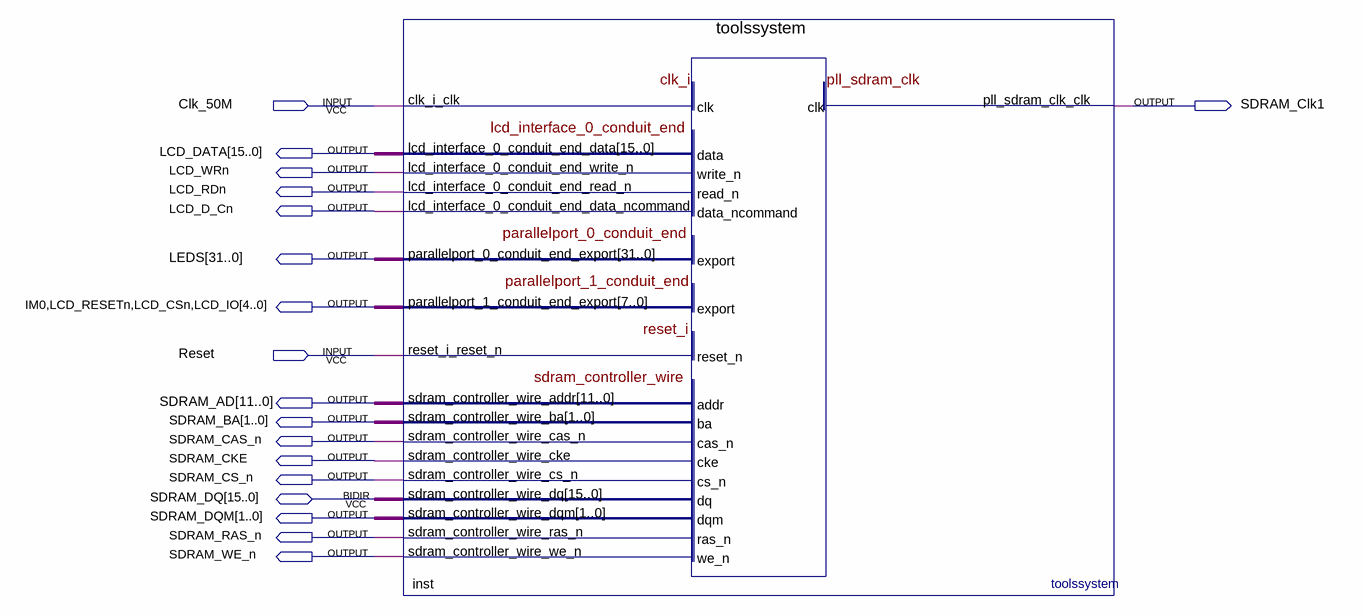
[diagram p0: schematic sheet]
// Quartus schematic tools.bdf as structural Verilog: 1 symbols, 18 pins
module tools (
  input  Clk_50M,
  input  Reset,
  inout  [15:0] SDRAM_DQ,
  output SDRAM_Clk1,
  output [15:0] LCD_DATA,
  output LCD_WRn,
  output LCD_RDn,
  output LCD_D_Cn,
  output [31:0] LEDS,
  output IM0,
  output LCD_RESETn,
  output LCD_CSn,
  output [4:0] LCD_IO,
  output [11:0] SDRAM_AD,
  output [1:0] SDRAM_BA,
  output SDRAM_CAS_n,
  output SDRAM_CKE,
  output SDRAM_CS_n,
  output [1:0] SDRAM_DQM,
  output SDRAM_RAS_n,
  output SDRAM_WE_n
);

  toolssystem inst (
    .clk_i_clk(Clk_50M), .reset_i_reset_n(Reset), .lcd_interface_0_conduit_end_write_n(LCD_WRn),
    .lcd_interface_0_conduit_end_read_n(LCD_RDn), .lcd_interface_0_conduit_end_data_ncommand(LCD_D_Cn),
    .pll_sdram_clk_clk(SDRAM_Clk1), .sdram_controller_wire_addr(SDRAM_AD),
    .sdram_controller_wire_ba(SDRAM_BA), .sdram_controller_wire_cas_n(SDRAM_CAS_n),
    .sdram_controller_wire_cke(SDRAM_CKE), .sdram_controller_wire_cs_n(SDRAM_CS_n),
    .sdram_controller_wire_dqm(SDRAM_DQM), .sdram_controller_wire_ras_n(SDRAM_RAS_n),
    .sdram_controller_wire_we_n(SDRAM_WE_n), .lcd_interface_0_conduit_end_data(LCD_DATA),
    .parallelport_0_conduit_end_export(LEDS),
    .parallelport_1_conduit_end_export({IM0, LCD_RESETn, LCD_CSn, LCD_IO}),
    .sdram_controller_wire_dq(SDRAM_DQ));
endmodule
